# Altium schematic sheet Main.SchDoc
size A
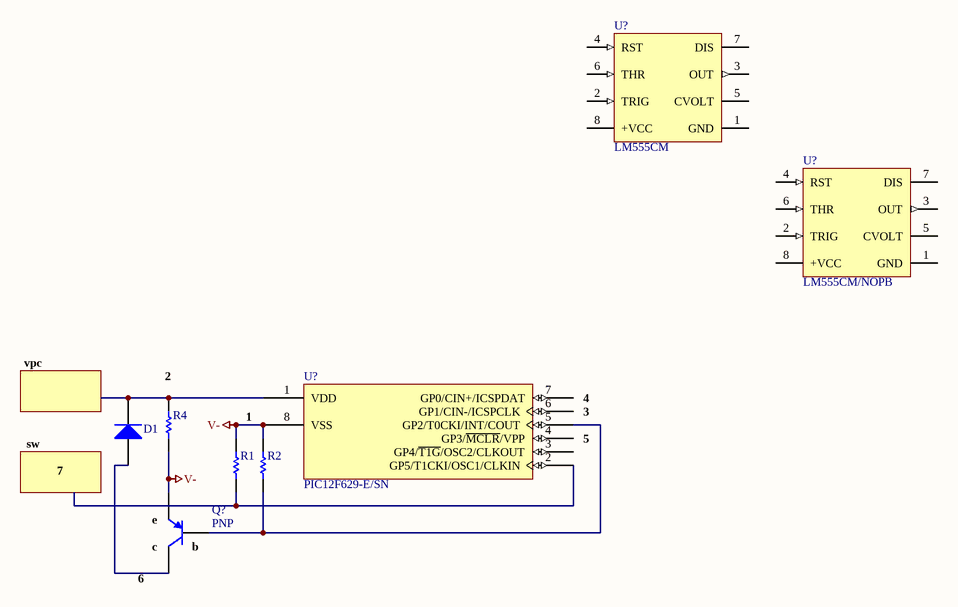
[diagram p0: Main.SchDoc]

## Parts
(Parts that share a designator on the sheet are numbered #1, #2 ... from top to bottom, then left to right.)
D1  Diode  [SMC]  (value not drawn)
Q?  PNP  [SOT-23B_N]
R1  Res1  [AXIAL-0.3]  (value not drawn)
R2  Res1  [AXIAL-0.3]  (value not drawn)
R4  Res1  [AXIAL-0.3]  (value not drawn)
U?#1  LM555CM  [M08A_N]
U?#2  LM555CM/NOPB  [M08A_N]
U?#3  PIC12F629-E/SN  [SOIC-SN8_N]

## Nets
V-: Q?.3(E) R1.2 R2.2 R4.1 U?#3.8(VSS)
NetD1_1: D1.1(A) Q?.1(C)
NetD1_2: D1.2(K) R4.2 U?#3.1(VDD)
NetQ?_2: Q?.2(B) R2.1 U?#3.5(GP2/T0CKI/INT/COUT)
NetR1_1: R1.1 U?#3.2(GP5/T1CKI/OSC1/CLKIN)

Not connected (* = marked no-connect by the designer): U?#1 1(GND) 2(TRIG) 3(OUT) 4(RST) 5(CVOLT) 6(THR) 7(DIS) 8(+VCC); U?#2 1(GND) 2(TRIG) 3(OUT) 4(RST) 5(CVOLT) 6(THR) 7(DIS) 8(+VCC); U?#3 3(GP4/~{T1G}/OSC2/CLKOUT) 4(GP3/~{MCLR}/VPP) 6(GP1/CIN-/ICSPCLK) 7(GP0/CIN+/ICSPDAT)

## Notes on the sheet
- vpc
- (near R4) 2
- 1
- (near U?#3) 3
- (near U?#3) 4
- sw
- 7
- (near U?#3) 5
- (near Q?) e
- (near Q?) c
- (near Q?) b
- (near Q?) 6

## Library data of the parts
D1 = Diode: Default Diode; Published: 8-Jun-2000; LatestRevisionDate: 17-Jul-2002; LatestRevisionNote: Re-released for DXP Platform.; PackageVersion: Sep-1996; PackageReference: SMC; Publisher: Altium Limited; PackageDescription: DO-214-AB/SMC; 2 C-Bend Leads; Body 7.9 x 5.9 mm, inc. leads (LxW); Code_JEDEC: DO-214-AB
Q? = PNP: PNP Bipolar Transistor; Published: 8-Jun-2000; LatestRevisionDate: 29-May-2009; LatestRevisionNote: IPC-7351 Footprint Added.; PackageVersion: Aug-1999; PackageReference: SOT-23B; Publisher: Altium Limited; PackageDescription: 3-Pin SOT-23 Package 0.95 mm Pitch, 2.4 mm Lead Span
R1 R2 R4 = Res1: Resistor; Value: 1K; Published: 8-Jun-2000; LatestRevisionDate: 17-Jul-2002; LatestRevisionNote: Re-released for DXP Platform.; PackageReference: AXIAL-0.3; Publisher: Altium Limited; PackageDescription: Axial Device, Thru-Hole; 2 Leads; 0.3 in Pin Spacing
U?#1 = LM555CM: Timer, 8-pin Narrow SOIC; Manufacturer: National Semiconductor; PackageTopMarking: NSZXTT*LM*555CM; PowerWise: N; CompType: Analog IC; High-Reliability: Y; DatasheetVersion: Jul-2006; PackageVersion: revM, May-2009; PackageReference: M08A; PackageDescription: SOIC Narrow, 4.9 x 3.9 x 1.45mm, 8 Lead, 1.27mm Pitch; PartNumber: LM555CM; RoHS: N; PinCount: 8; Code_JEDEC: MS-012-AA; Code_IPC: SOIC127P600-8; ComponentLink1Description: Manufacturer URL; ComponentLink1URL: http://www.national.com/; ComponentLink2Description: LM555 Datasheet; ComponentLink2URL: http://www.national.com/ds/LM/LM555.pdf; ComponentLink3Description: LM555 Web Page; ComponentLink3URL: http://www.national.com/pf/LM/LM555.html; ComponentLink4Description: M08A Package Page; ComponentLink4URL: http://www.national.com/packaging/folders/m08a.html
U?#2 = LM555CM/NOPB: Timer, 8-pin Narrow SOIC, Pb-Free; Manufacturer: National Semiconductor; PackageTopMarking: NSZXTT*LM*555CM; PowerWise: N; CompType: Analog IC; High-Reliability: Y; DatasheetVersion: Jul-2006; PackageVersion: revM, May-2009; PackageReference: M08A; PackageDescription: SOIC Narrow, 4.9 x 3.9 x 1.45mm, 8 Lead, 1.27mm Pitch; PartNumber: LM555CM/NOPB; RoHS: Y; PinCount: 8; Code_JEDEC: MS-012-AA; Code_IPC: SOIC127P600-8; ComponentLink1Description: Manufacturer URL; ComponentLink1URL: http://www.national.com/; ComponentLink2Description: LM555 Datasheet; ComponentLink2URL: http://www.national.com/ds/LM/LM555.pdf; ComponentLink3Description: LM555 Web Page; ComponentLink3URL: http://www.national.com/pf/LM/LM555.html; ComponentLink4Description: M08A Package Page; ComponentLink4URL: http://www.national.com/packaging/folders/m08a.html
U?#3 = PIC12F629-E/SN: FLASH-Based 8-Bit CMOS Microcontroller, 8-Pin SOIC 150mil, Extended Temperature; Manufacturer: Microchip; DatasheetVersion: revF, Sep-2009; PackageVersion: revBB, Aug-2009; PackageReference: SOIC-SN8; PackageDescription: 8-Lead Plastic Small Outline (SN) - Narrow, 3.90mm Body [SOIC]; Code_JEDEC: MS-012; Code_IPC: SOIC127P600-8; PartNumber: PIC12F629-E/SN; ComponentLink1Description: Manufacturer URL; ComponentLink1URL: http://www.microchip.com/; ComponentLink2Description: Datasheet; ComponentLink2URL: http://ww1.microchip.com/downloads/en/DeviceDoc/41190F.pdf; ComponentLink3Description: Package Specification; ComponentLink3URL: http://www.microchip.com/stellent/groups/techpub_sg/documents/packagingspec/en012702.pdf